# EAGLE design Schematics (EAGLE 9.1.0)
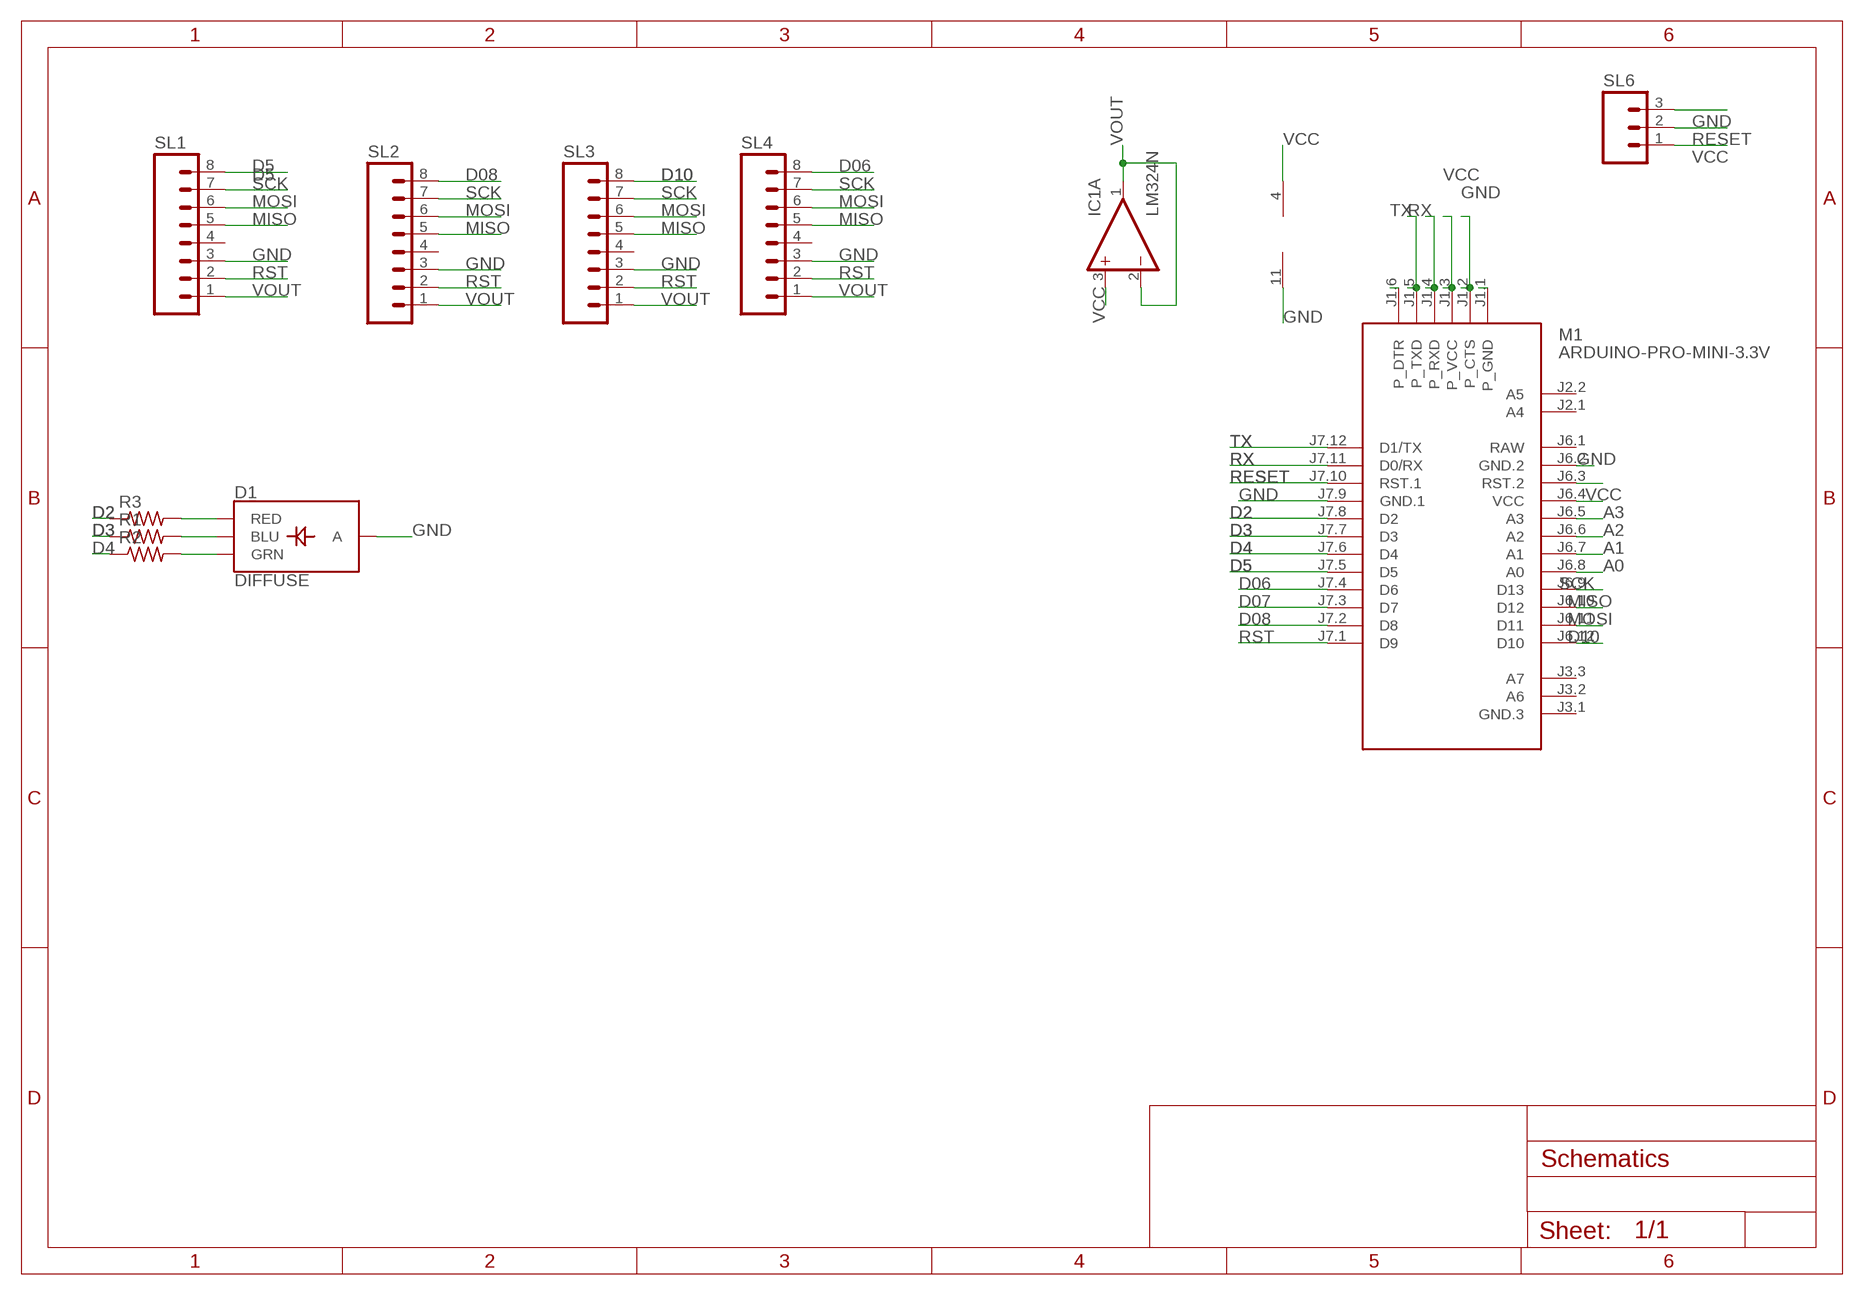
[diagram p0: schematic, sheet 1]

## Parts
D1  DIFFUSE  LED-RGB-CADIFFUSE  [LED-RGB-THRU]
IC1  LM324N  [DIL14]
M1  ARDUINO-PRO-MINI-3.3V  [ARDUINO-PRO-MINI]
R1  R-US_0204/7  [0204/7]
R2  R-US_0204/7  [0204/7]
R3  R-US_0204/7  [0204/7]
SL1  M08  [08P]
SL2  M08  [08P]
SL3  M08  [08P]
SL4  M08  [08P]
SL6  M03  [03P]

## Nets
A0: M1.J6.8(A0)
A1: M1.J6.7(A1)
A2: M1.J6.6(A2)
A3: M1.J6.5(A3)
D2: M1.J7.8(D2) R3.1
D3: M1.J7.7(D3) R1.1
D4: M1.J7.6(D4) R2.1
D5: M1.J7.5(D5) SL1.8
D06: M1.J7.4(D6) SL4.8
D07: M1.J7.3(D7)
D08: M1.J7.2(D8) SL2.8
D10: M1.J6.12(D10) SL3.8
GND: D1.2(A) IC1.11(P:V-) M1.J1.2(P_CTS) M1.J6.2(GND.2) M1.J7.9(GND.1) SL1.3 SL2.3 SL3.3 SL4.3 SL6.3
MISO: M1.J6.10(D12) SL1.5 SL2.5 SL3.5 SL4.5
MOSI: M1.J6.11(D11) SL1.6 SL2.6 SL3.6 SL4.6
N$1: M1.J1.6(P_DTR)
N$2: M1.J6.3(RST.2)
N$6: M1.J1.1(P_GND)
N$7: D1.1(RED) R3.2
N$13: D1.3(GRN) R2.2
N$14: D1.4(BLU) R1.2
RESET: M1.J7.10(RST.1) SL6.2
RST: M1.J7.1(D9) SL1.2 SL2.2 SL3.2 SL4.2
RX: M1.J1.4(P_RXD) M1.J7.11(D0/RX)
SCK: M1.J6.9(D13) SL1.7 SL2.7 SL3.7 SL4.7
TX: M1.J1.5(P_TXD) M1.J7.12(D1/TX)
VCC: IC1.3(A:+IN) IC1.4(P:V+) M1.J1.3(P_VCC) M1.J6.4(VCC) SL6.1
VOUT: IC1.1(A:OUT) IC1.2(A:-IN) SL1.1 SL2.1 SL3.1 SL4.1
Unconnected: IC1.5(B:+IN) IC1.6(B:-IN) IC1.7(B:OUT) IC1.8(C:OUT) IC1.9(C:-IN) IC1.10(C:+IN) IC1.12(D:+IN) IC1.13(D:-IN) IC1.14(D:OUT) M1.J2.1(A4) M1.J2.2(A5) M1.J3.1(GND.3) M1.J3.2(A6) M1.J3.3(A7) SL1.4 SL2.4 SL3.4 SL4.4

## Power pins joined to a net without a drawn wire
RAW: M1.J6.1(RAW)

## Library data of the parts
D1 = SparkFun-LED:LED-RGB-CA: LED-RGB Diffused Common Anode Packages: LED RGB-THRU P-LCC-4-3 LED-TRICOLOR-SMD SparkFun Products: RGB Diffused Common Anode- Diffuse <[https://www.sparkfun.com/products/10821]> RGB Diffused Common Anode - Clear <[https://www.sparkfun.com/products/10820]> Qduino Mini <[https://www.sparkfun.com/products/13614]> Triple Output LED RGB - SMD <https://www.sparkfun.com/products/7844>; PROD_ID: DIO-10632
IC1 = linear:LM324: OP AMP
M1 = diy-modules:ARDUINO-PRO-MINI-*: Arduino Pro Mini and compatible devices More details available here: https://www.arduino.cc/en/Main/ArduinoBoardProMini Click here to find device on ebay.com <http://www.ebay.com/sch/arduino+pro+mini>
R1-R3 = resistor:R-US_: RESISTOR, American symbol
SL1-SL4 = con-amp-quick:M08: AMP QUICK CONNECTOR; OC_FARNELL: unknown; OC_NEWARK: unknown
SL6 = con-amp-quick:M03: AMP QUICK CONNECTOR; OC_FARNELL: unknown; OC_NEWARK: unknown

## Board
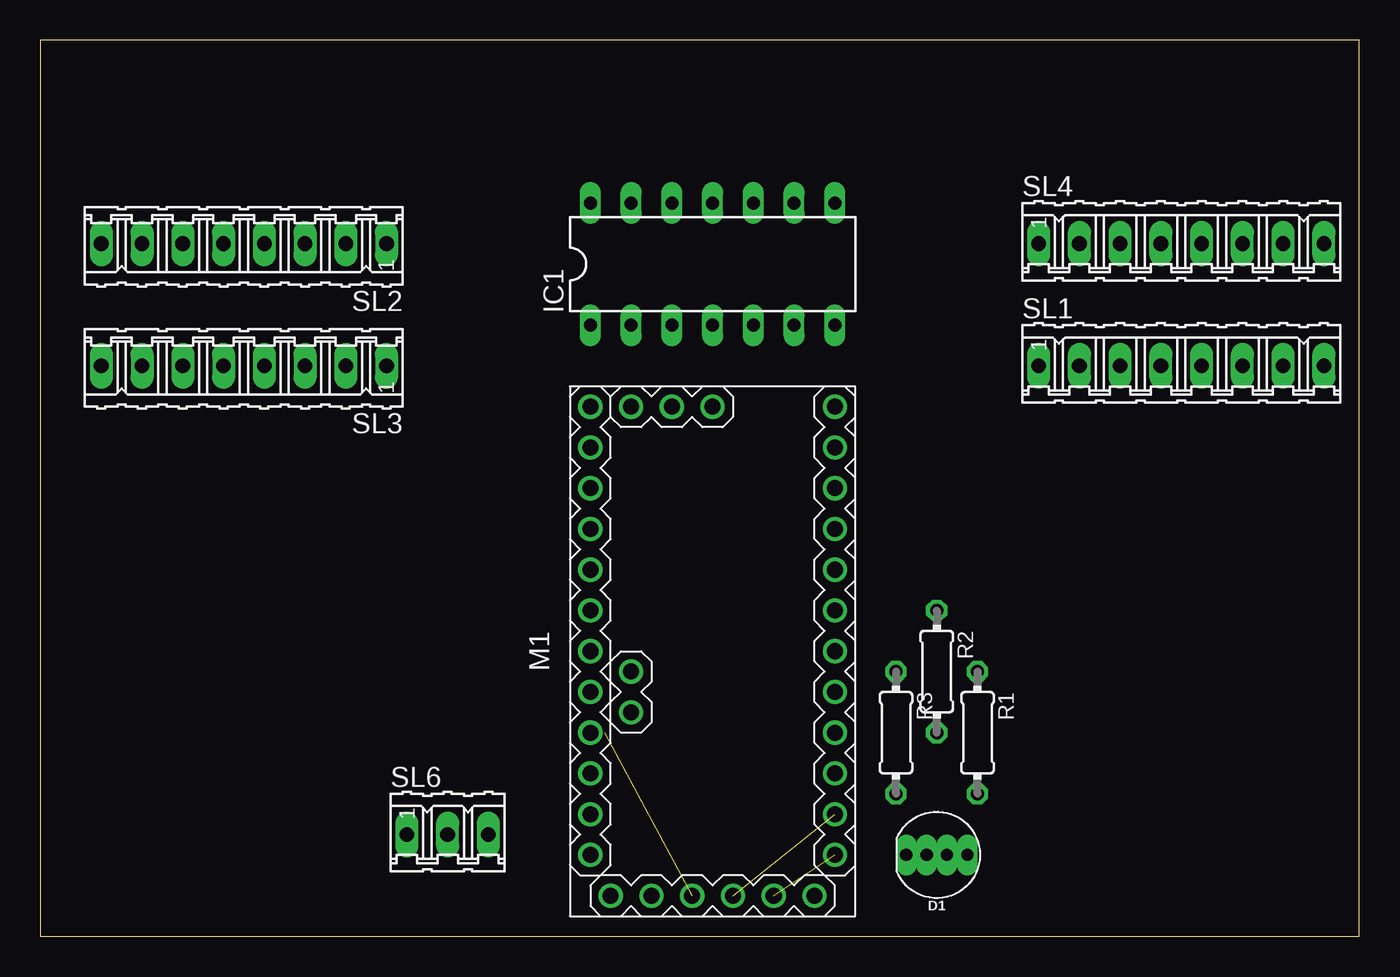
[diagram p1: board, top side]
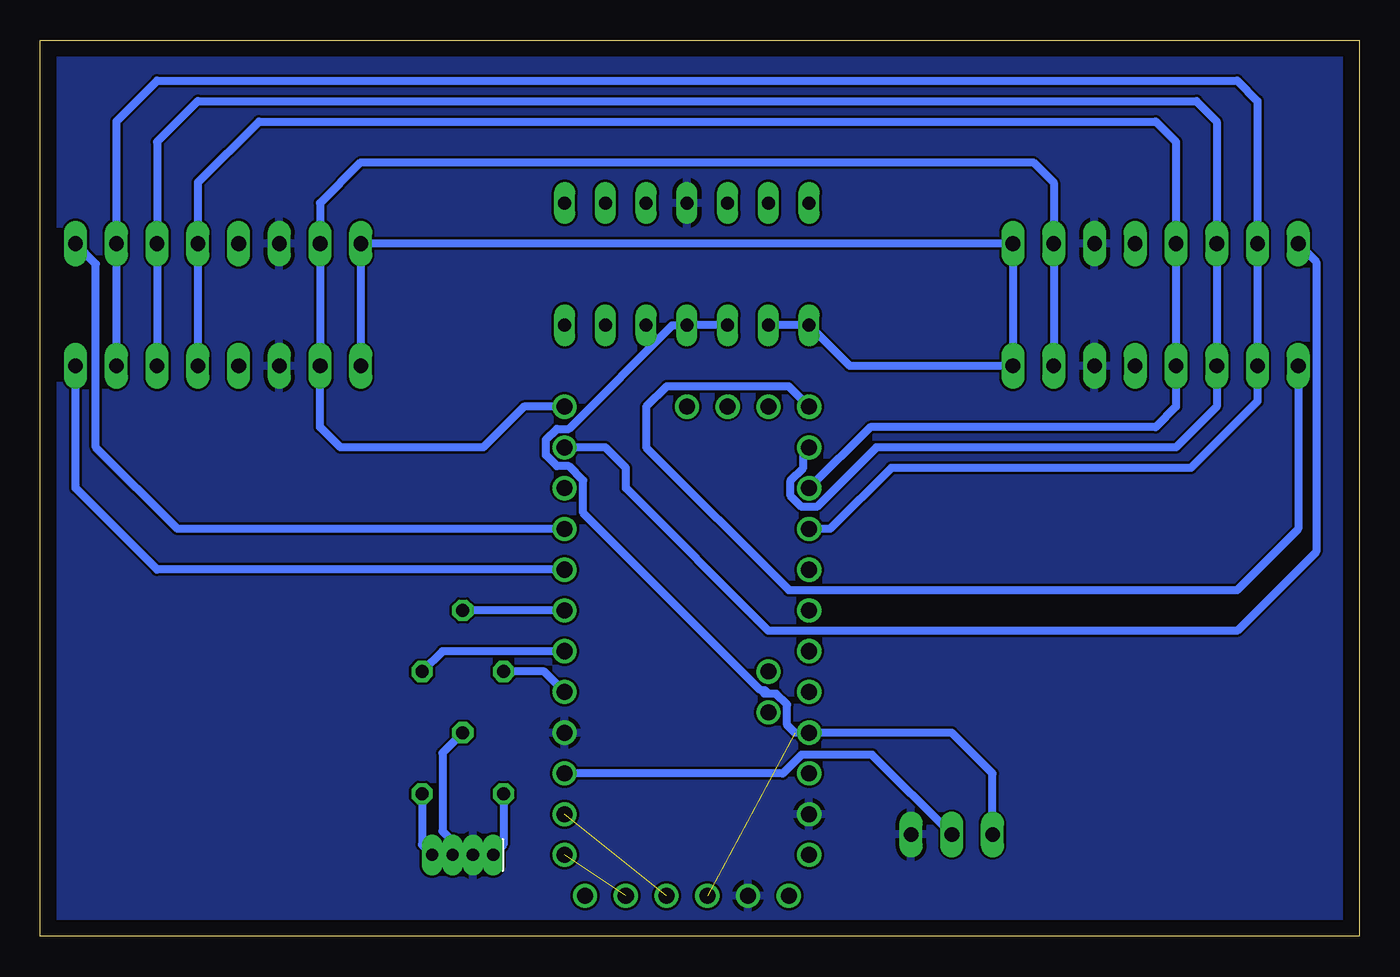
[diagram p2: board, bottom side, seen from below]

Size 82.22 x 55.87 mm. Coordinates in mm from the lower left corner, seen from the top.
Outline: 0,0 82.22,0 82.22,55.87 0,55.87 0,0
Copper layers (1*16): Top 0.035mm / dielectric 1.5mm / Bottom 0.035mm
Design rules "default": minimum track width 6mil, minimum drill 0.35mm, track to track 6mil, track to pad 6mil, pad to pad 6mil, via to via 6mil, smd to smd 6mil, copper to edge 40mil, drill to drill 6mil, minimum pad ring 10mil, minimum via ring 8mil, stop-mask expansion 4mil, vias tented up to drill 0mil, thermal gap 10mil

### Footprints (pad centres in the part's own frame; a part is rotated, then mirrored left to right if it is on the bottom)
LED-RGB-THRU = drill 0.762 pad 0.889 long: 1 1.905,0; 2 0.635,0; 3 -0.635,0; 4 -1.905,0
DIL14 = drill 0.813 long: 1 -7.62,-3.81; 2 -5.08,-3.81; 3 -2.54,-3.81; 4 0,-3.81; 5 2.54,-3.81; 6 5.08,-3.81; 7 7.62,-3.81; 8 7.62,3.81; 9 5.08,3.81; 10 2.54,3.81; 11 0,3.81; 12 -2.54,3.81; 13 -5.08,3.81; 14 -7.62,3.81
ARDUINO-PRO-MINI = drill 1: J1.1 -15.24,6.35; J1.2 -15.24,3.81; J1.3 -15.24,1.27; J1.4 -15.24,-1.27; J1.5 -15.24,-3.81; J1.6 -15.24,-6.35; J2.1 -1.27,5.08; J2.2 -3.81,5.08; J3.1 15.24,0; J3.2 15.24,2.54; J3.3 15.24,5.08; J6.1 -12.7,7.62; J6.2 -10.16,7.62; J6.3 -7.62,7.62; J6.4 -5.08,7.62; J6.5 -2.54,7.62; J6.6 0,7.62; J6.7 2.54,7.62; J6.8 5.08,7.62; J6.9 7.62,7.62; J6.10 10.16,7.62; J6.11 12.7,7.62; J6.12 15.24,7.62; J7.1 15.24,-7.62; J7.2 12.7,-7.62; J7.3 10.16,-7.62; J7.4 7.62,-7.62; J7.5 5.08,-7.62; J7.6 2.54,-7.62; J7.7 0,-7.62; J7.8 -2.54,-7.62; J7.9 -5.08,-7.62; J7.10 -7.62,-7.62; J7.11 -10.16,-7.62; J7.12 -12.7,-7.62
0204/7 = drill 0.813 octagon: 1 -3.81,0; 2 3.81,0
08P = drill 0.914 long: 1 -8.89,0; 2 -6.35,0; 3 -3.81,0; 4 -1.27,0; 5 1.27,0; 6 3.81,0; 7 6.35,0; 8 8.89,0
03P = drill 0.914 long: 1 -2.54,0; 2 0,0; 3 2.54,0

### Placement (x,y rotation side)
D1  55.88,5.08 180 top
IC1  41.91,41.91 0 top
M1  41.91,17.78 90 top
R1  58.42,12.7 270 top
R2  55.88,16.51 270 top
R3  53.34,12.7 270 top
SL1  71.12,35.56 0 top
SL2  12.7,43.18 180 top
SL3  12.7,35.56 180 top
SL4  71.12,43.18 0 top
SL6  25.4,6.35 0 top

### Tracks (layer width: path | path; a pad name or v marks a point on that pad's centre or on a via)
D2
  Bottom 0.508: M1.J7.8 50.8,16.51 R3.1
D3
  Bottom 0.508: M1.J7.7 57.15,17.78 R1.1
D4
  Bottom 0.508: M1.J7.6 R2.1
D5
  Bottom 0.508: M1.J7.5 74.93,22.86 80.01,27.94 SL1.8
D06
  Bottom 0.508: M1.J7.4 73.66,25.4 78.74,30.48 78.74,41.91 SL4.8
D08
  Bottom 0.508: SL2.8 2.69,42.06 2.69,23.98 7.62,19.05 36.83,19.05 45.72,27.94 45.72,29.21 46.99,30.48 M1.J7.2
D10
  Bottom 0.508: SL3.8 3.81,25.4 7.62,21.59 35.56,21.59 44.45,30.48 44.45,33.02 43.18,34.29 35.56,34.29 M1.J6.12
GND
  pour Bottom: 0,55.88 0,0 83.82,0 83.82,55.88
MISO
  Bottom 0.508: SL1.5 SL4.5 72.39,46.99 68.58,50.8 12.7,50.8 11.43,49.53 SL2.5 SL3.5 11.43,33.02 12.7,31.75 30.48,31.75 M1.J6.10
MOSI
  Bottom 0.508: SL1.6 SL4.6 74.93,49.53 72.39,52.07 10.16,52.07 8.89,50.8 SL2.6 SL3.6 8.89,33.02 11.43,30.48 30.11,30.48 33.81,26.78 34.77,26.78 35.45,27.46 35.45,28.42 34.66,29.21 34.66,30.48 M1.J6.11
N$7
  Bottom 0.508: R3.2 53.34,5.71 D1.1
N$13
  Bottom 0.508: R2.2 57.15,11.43 57.15,6.55 56.74,6.15 56.74,5.31 D1.3
N$14
  Bottom 0.508: R1.2 58.42,5.71 D1.4
RESET
  Bottom 0.508: M1.J7.10 35.93,10.16 34.77,11.32 30.37,11.32 SL6.2
RST
  Bottom 0.508: SL3.2 SL2.2 19.05,46.99 20.32,48.26 62.23,48.26 64.77,45.72 SL4.2 SL1.2 64.77,31.75 63.5,30.48 54.61,30.48 52.07,33.02 M1.J7.1
RX  (1 unrouted)
SCK
  Bottom 0.508: SL1.7 SL4.7 77.47,50.8 74.93,53.34 7.62,53.34 6.35,52.07 SL2.7 SL3.7 6.35,33.36 10.5,29.21 29.18,29.21 32.98,25.4 M1.J6.9
TX  (1 unrouted)
VCC  (1 unrouted)
  Bottom 0.508: IC1.3 IC1.4 42.81,38.1 49.27,31.64 50.01,31.64 50.69,30.96 50.69,30 50.01,29.32 49.27,29.32 48.37,28.42 48.37,26.41 37.31,15.35 37.05,15.35 36.83,15.13 | 36.83,15.13 36.35,15.13 35.67,14.45 35.67,13.18 35.19,12.7 M1.J6.4 25.4,12.7 22.86,10.16 SL6.1 | 36.83,15.13 37.09,15.13
VOUT
  Bottom 0.508: SL1.1 SL4.1 SL2.1 SL3.1 31.75,35.56 IC1.1 IC1.2